# Altium project EJ3 Moore.PrjPCB
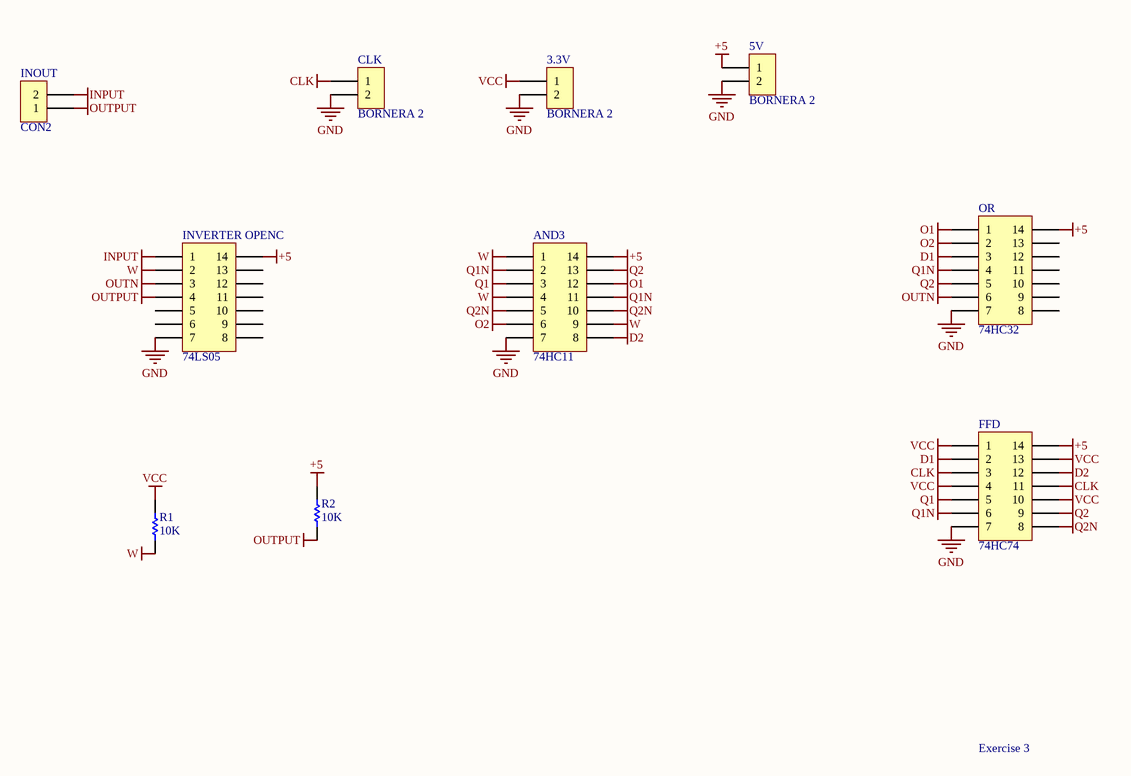
[diagram p0: Schematic.SchDoc]
1 sheet, 10 parts. Net scope: global (net labels, ports and power ports of the same name join across sheets).
Board file: PCB.PcbDoc

## Sheet Schematic.SchDoc
size A4

### Parts
3.3V  BORNERA 2  [BORNERA2]
5V  BORNERA 2  [BORNERA2]
AND3  74HC11  [DIP14]
CLK  BORNERA 2  [BORNERA2]
FFD  74HC74  [DIP14]
INOUT  CON2  [SIP2]
INVERTER_OPENC  74LS05  [DIP14]
OR  74HC32  [DIP14]
R1  10K  [RES400]
R2  10K  [RES400]

### Nets
+5: 5V.1 AND3.14 FFD.14 INVERTER_OPENC.14 OR.14 R2.2
CLK: CLK.1 FFD.3 FFD.11
D1: FFD.2 OR.3
D2: AND3.8 FFD.12
GND: 3.3V.2 5V.2 AND3.7 CLK.2 FFD.7 INVERTER_OPENC.7 OR.7
INPUT: INOUT.2 INVERTER_OPENC.1
O1: AND3.12 OR.1
O2: AND3.6 OR.2
OUTN: INVERTER_OPENC.3 OR.6
OUTPUT: INOUT.1 INVERTER_OPENC.4 R2.1
Q1: AND3.3 FFD.5
Q1N: AND3.2 AND3.11 FFD.6 OR.4
Q2: AND3.13 FFD.9 OR.5
Q2N: AND3.5 AND3.10 FFD.8
VCC: 3.3V.1 FFD.1 FFD.4 FFD.10 FFD.13 R1.2
W: AND3.1 AND3.4 AND3.9 INVERTER_OPENC.2 R1.1

Not connected (* = marked no-connect by the designer): INVERTER_OPENC 5 6 8 9 10 11 12 13; OR 8 9 10 11 12 13

### Notes on the sheet
- Exercise 3

### Library data of the parts
AND3 FFD INVERTER_OPENC OR = IC_DIP14
R1 R2 = RES